# EasyEDA Pro project WEN-验证板合集2.epro

# Schematic 验证板2
Board Name: WEN-验证板合集2; Create Date: 2025-05-11; Page Name: BUF634A三通道缓冲器; Project Name: 【电赛模块】2025电赛预制模块mmkk; Schematic Name: 验证板2; Update Date: 2025-05-11; Company: 嘉立创EDA; Page Size: A1; Version: V1.0
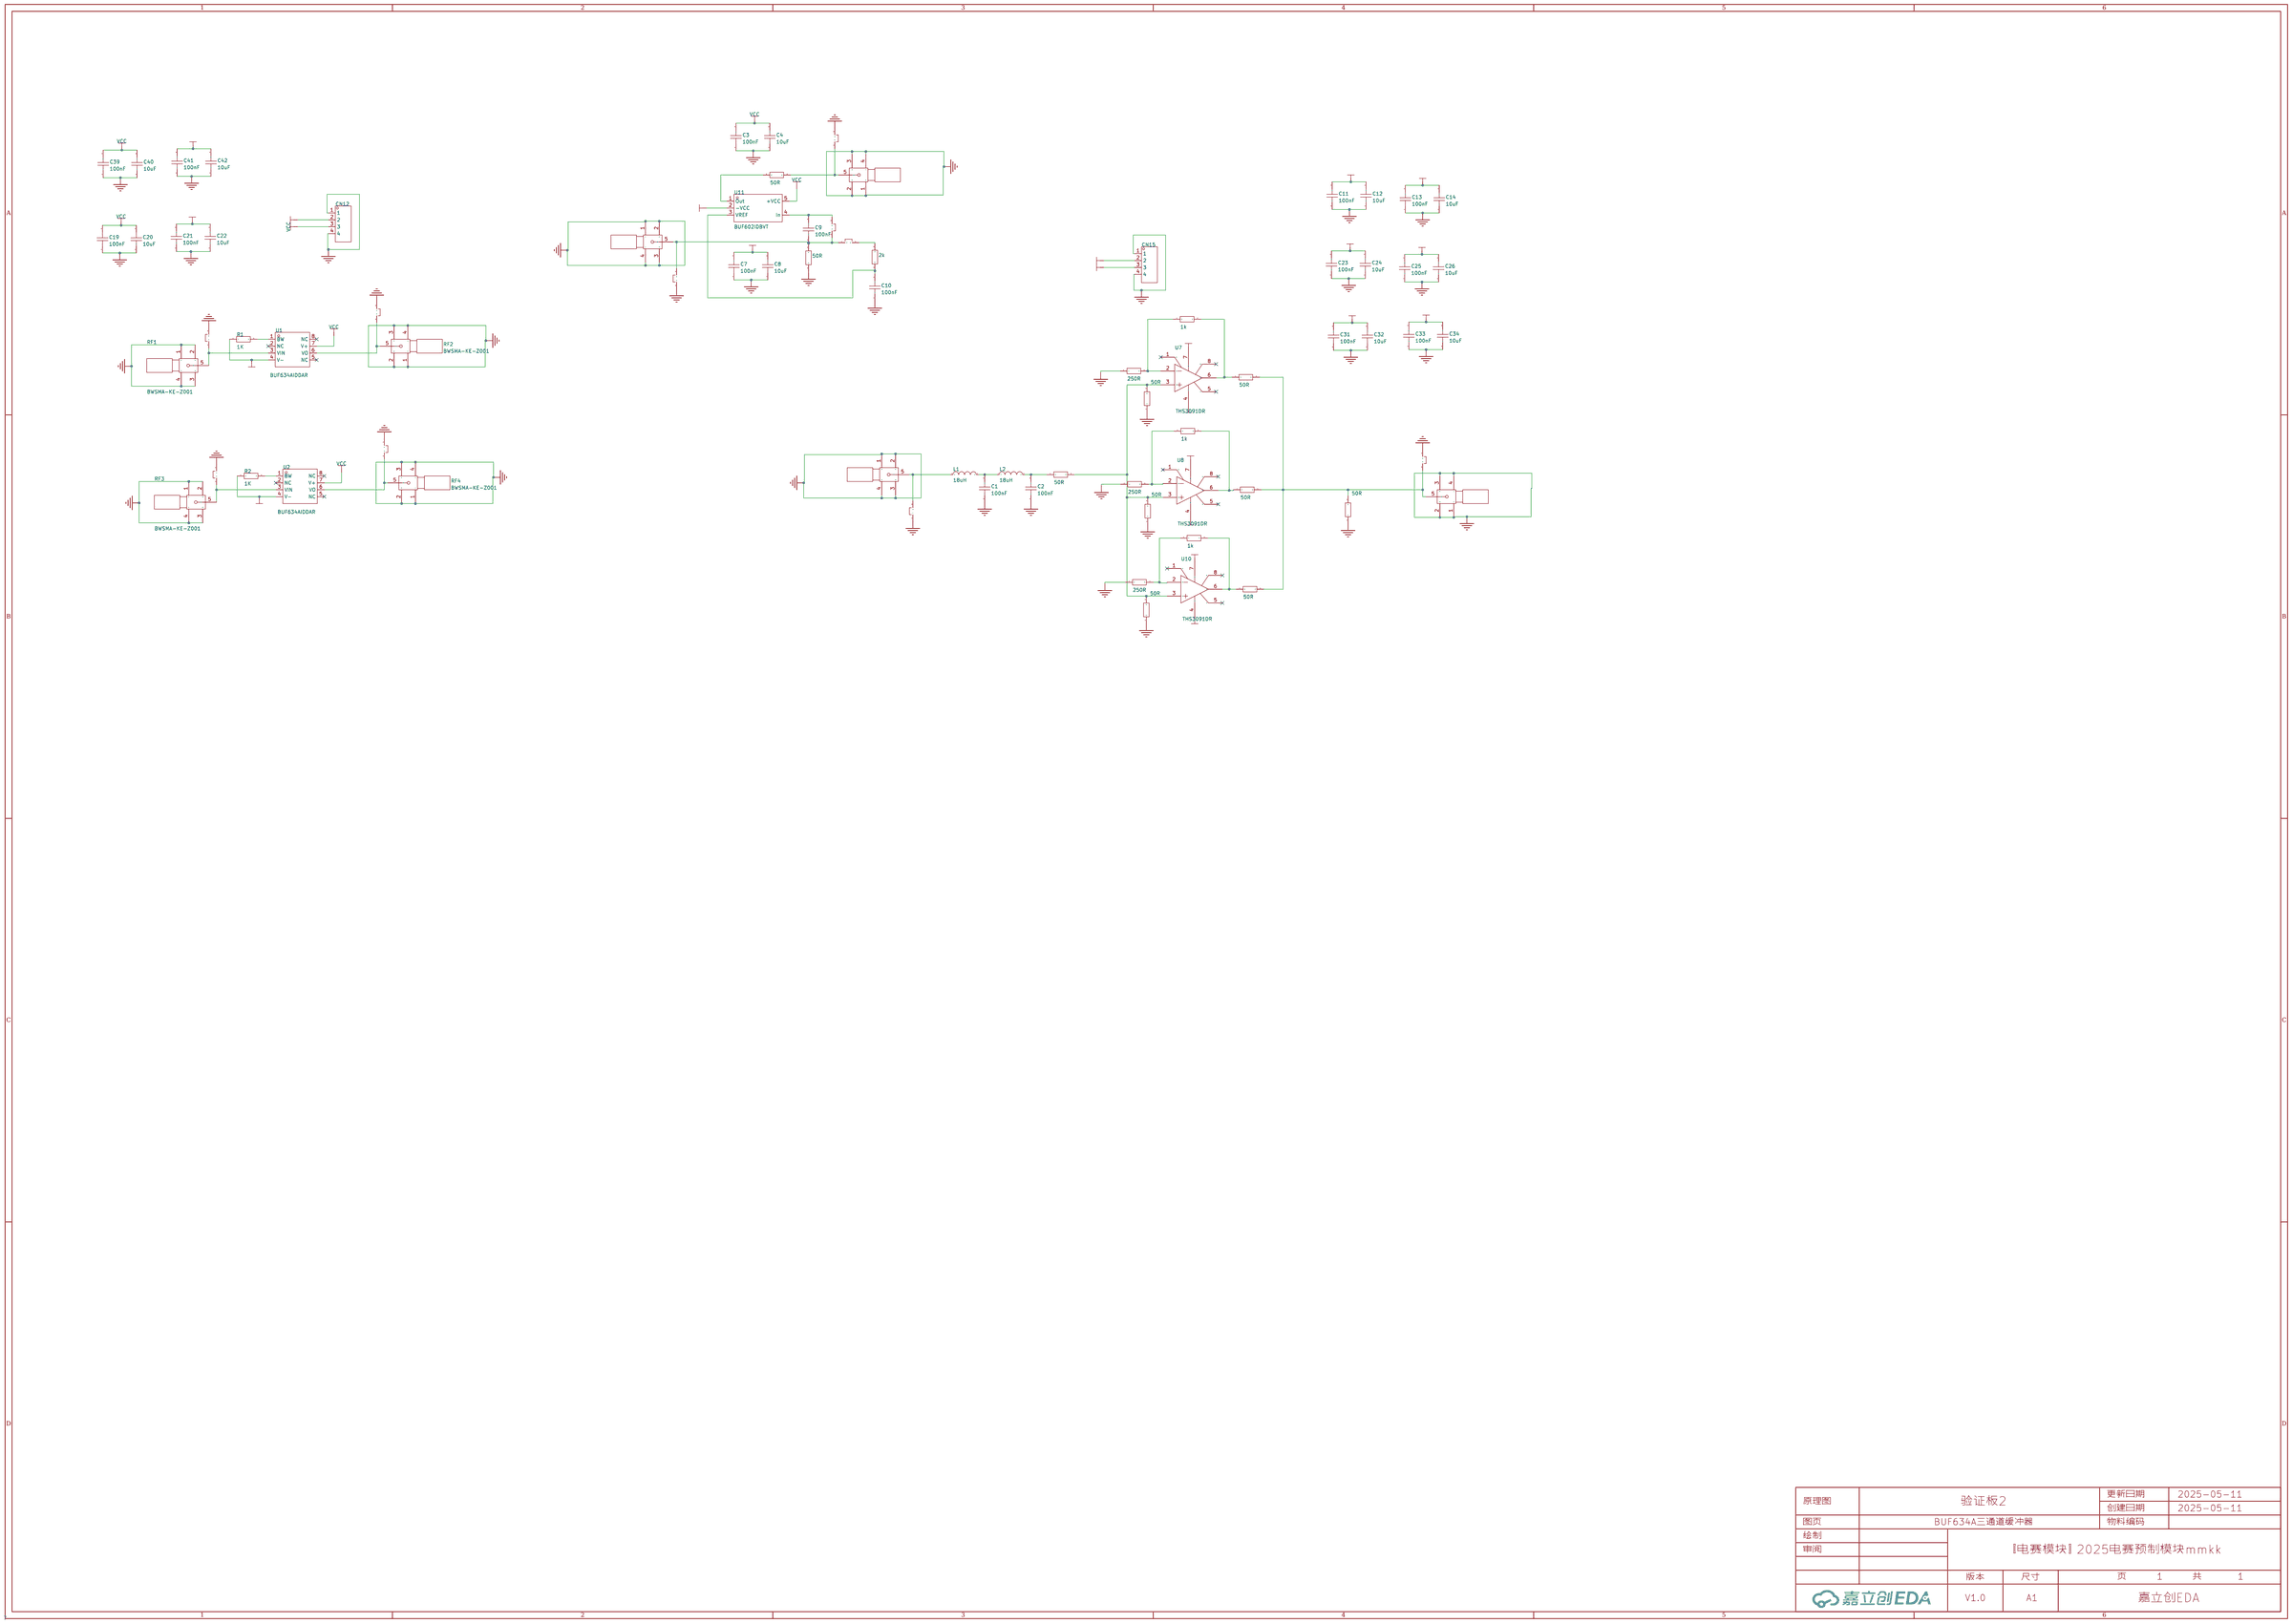
[diagram p0: schematic sheet]

## Parts
C1  100nF  [C0805]
C2  100nF  [C0805]
C3  100nF  [C0805]
C4  10uF  [C0805]
C7  100nF  [C0805]
C8  10uF  [C0805]
C9  100nF  [C0805]
C10  100nF  [C0805]
C11  100nF  [C0805]
C12  10uF  [C0805]
C13  100nF  [C0805]
C14  10uF  [C0805]
C19  100nF  [C0805]
C20  10uF  [C0805]
C21  100nF  [C0805]
C22  10uF  [C0805]
C23  100nF  [C0805]
C24  10uF  [C0805]
C25  100nF  [C0805]
C26  10uF  [C0805]
C31  100nF  [C0805]
C32  10uF  [C0805]
C33  100nF  [C0805]
C34  10uF  [C0805]
C39  100nF  [C0805]
C40  10uF  [C0805]
C41  100nF  [C0805]
C42  10uF  [C0805]
CN12  WJ15EDGVC-3.81-4P  [CONN-TH_4P-P3.81_WJ2EDGVC-3.81-4P]
CN15  WJ15EDGVC-3.81-4P  [CONN-TH_4P-P3.81_WJ2EDGVC-3.81-4P]
H1  PZ254V-11-02P  [HDR-TH_2P-P2.54-V-M]
H2  PZ254V-11-02P  [HDR-TH_2P-P2.54-V-M]
H3  PZ254V-11-02P  [HDR-TH_2P-P2.54-V-M]
H4  PZ254V-11-02P  [HDR-TH_2P-P2.54-V-M]
H5  PZ254V-11-02P  [HDR-TH_2P-P2.54-V-M]
H6  PZ254V-11-02P  [HDR-TH_2P-P2.54-V-M]
H7  PZ254V-11-02P  [HDR-TH_2P-P2.54-V-M]
H8  PZ254V-11-02P  [HDR-TH_2P-P2.54-V-M]
H9  PZ254V-11-02P  [HDR-TH_2P-P2.54-V-M]
H10  PZ254V-11-02P  [HDR-TH_2P-P2.54-V-M]
L1  18uH  [L0805]
L2  18uH  [L0805]
R1  1K  [R0603]
R2  1K  [R0603]
R7  1K  [R0603]
R8  1K  [R0603]
R10  1K  [R0603]
R11  1K  [R0603]
R12  1K  [R0603]
R13  1K  [R0603]
R14  1K  [R0603]
R15  1K  [R0603]
R16  1K  [R0603]
R17  1K  [R0603]
R18  1K  [R0603]
R19  1K  [R0603]
R22  1K  [R0603]
R23  1K  [R0603]
R24  1K  [R0603]
R26  1K  [R0603]
R27  1K  [R0603]
RF1  BWSMA-KE-Z001  [SMA-TH_BWSMA-KE-Z001]
RF2  BWSMA-KE-Z001  [SMA-TH_BWSMA-KE-Z001]
RF3  BWSMA-KE-Z001  [SMA-TH_BWSMA-KE-Z001]
RF4  BWSMA-KE-Z001  [SMA-TH_BWSMA-KE-Z001]
RF5  BWSMA-KE-Z001  [SMA-TH_BWSMA-KE-Z001]
RF6  BWSMA-KE-Z001  [SMA-TH_BWSMA-KE-Z001]
RF7  BWSMA-KE-Z001  [SMA-TH_BWSMA-KE-Z001]
RF8  BWSMA-KE-Z001  [SMA-TH_BWSMA-KE-Z001]
U1  BUF634AIDDAR  [SOIC-8_L4.9-W3.9-P1.27-LS6.0-BL]
U2  BUF634AIDDAR  [SOIC-8_L4.9-W3.9-P1.27-LS6.0-BL]
U7  THS3091DR  [SOIC-8_L4.9-W3.9-P1.27-LS6.0-BL]
U8  THS3091DR  [SOIC-8_L4.9-W3.9-P1.27-LS6.0-BL]
U10  THS3091DR  [SOIC-8_L4.9-W3.9-P1.27-LS6.0-BL]
U11  BUF602IDBVT  [SOT-23-5_L2.9-W1.6-P0.95-LS2.8-BL]

## Library data of the parts
C1-C4 C7-C14 C19-C26 C31-C34 C39-C42 = CAP_0805: Supplier Footprint: 0805
CN12 CN15 = WJ15EDGVC-3.81-4P: 连接器类型:板端/插座-闭口;固定方式:-;结构:1x4P;间距:3.81mm;颜色:-;安装方式:直针;排数:1;每排PIN数:4;额定电流:8A;额定电压:300V;线规 - AWG:-;线规 - 平方毫米:-;触头材质:黄铜;触头镀层:锡;工作温度范围:-40℃~+105℃;焊接温度(最大值):-;; LCSC Part Name: 1x4P 3.81mm 排数:1 每排P数:4; Supplier Part: C8410; Manufacturer: KANGNEX(康奈克斯电气); Supplier Footprint: 插件,P=3.81mm; JLCPCB Part Class: 扩展库; Datasheet: https://atta.szlcsc.com/upload/public/pdf/source/20191225/C8410_C8794F457058DA07325589F32B6A11CC.pdf; Supplier: LCSC; Connector Type: 板端/插座-闭口; Structure: 1x4P; Pitch: 3.81mm; Mounting Style: 直针; Number of Pins: 4P; Number of Rows: 1; Number of PINs Per Row: 4; Current Rating (Max): 8A; Voltage Rating (Max): 300V; Contact Material: 黄铜; Contact Plating: 锡; Operating Temperature Range: -40℃~+105℃
H1-H10 = PZ254V-11-02P: 排数:单排;总PIN位数:2;间距:2.54mm;插针结构:1x2P;行距:-;安装类型:直插;圆针/方针:方针;额定电流:-;额定电压:-;配合针长度:6mm;塑高:2.5mm;端接针长度:3mm;触头材质:黄铜;触头镀层:-;工作温度范围:-40℃~+105℃;颜色:黑色;; LCSC Part Name: 2.54mm 1x2P 直插 方针; Supplier Part: C492401; Manufacturer: XFCN(兴飞); Supplier Footprint: 直插,P=2.54mm; JLCPCB Part Class: Extended Part; Datasheet: https://atta.szlcsc.com/upload/public/pdf/source/20200309/C492401_A812433581A9B211A7FFA413ADDFF0E5.pdf; Supplier: LCSC; Number of Rows: 单排; Number of Pins: 2; Pitch: 2.54mm; Pin Structure: 1x2P; Mounting Type: 直插; Circluar Pins/Square Pins: 方针; Length of Mating Pin: 6mm; Insulation Height: 2.5mm; Length of End Connection Pin: 3mm; Contact Material: 黄铜; Operating Temperature Range: -40℃~+105℃; Color: 黑色
L1 L2 = L_0805
R1 R2 R7 R8 R10-R19 R22-R24 R26 R27 = Res_0603: Supplier Footprint: 0603
RF1-RF8 = 【直插】BWSMA-KE-Z001_C496549: 连接器类型:板端;接口类型:内孔;端口数量:1;接口直径:-;接口长度/高度:-;频率-最大值:-;射频系列:SMA;阻抗:50Ω;样式:正脚;触头材质:-;触头镀层:-;工作温度范围:-65℃~+165℃;焊接温度(最大值):-;; LCSC Part Name: 内孔 SMA 正脚; Supplier Part: C496549; Manufacturer: BAT WIRELESS(蝙蝠无线); Supplier Footprint: 插件; JLCPCB Part Class: 扩展库; Datasheet: https://atta.szlcsc.com/upload/public/pdf/source/20221228/40BF41E56A06003A0210E1785CA66EA6.pdf; Supplier: LCSC; Connector Type: 板端; Interface Type: 内孔; Number of Ports: 1; RF Series: SMA; Impedance: 50Ω; Style: 正脚; Operating Temperature Range: -65℃~+165℃
U1 U2 = BUF634AIDDAR: 放大器数:单路;轨到轨:-;增益带宽积(GBP):-;输入失调电压(Vos):65mV;压摆率(SR):3750V/us;输入偏置电流(Ib):250nA;; Supplier Part: C2864582; Manufacturer: TI(德州仪器); Supplier Footprint: SOIC-8; JLCPCB Part Class: Extended Part; Datasheet: https://www.ti.com/cn/lit/gpn/buf634a; Supplier: LCSC; Number of Circuits: 单路; Maximum Power Supply Range (Vdd-Vss): 36V; Voltage - Input Offset(Vos): 65mV; Input Offset Voltage Drift (Vos TC): 175uV/℃; Slew Rate(SR): 3750V/us; Current - Input Bias(Ib): 250nA; Noise density(eN): 3.4nV/√Hz@1kHz; Output Current: 250mA; Operating Temperature: -40℃~+125℃
U7 U8 U10 = THS3091DR: 放大器数:单路;增益带宽积(GBP):-;输入偏置电流(Ib):4uA;压摆率(SR):7300V/us;带宽(-3db):235MHz;; Supplier Part: C2060367; Manufacturer: TI(德州仪器); Supplier Footprint: SOIC-8; JLCPCB Part Class: 扩展库; Datasheet: https://www.ti.com/cn/lit/gpn/ths3091; Supplier: LCSC; Number of Circuits: 单路; Current - Input Bias(Ib): 4uA; Slew Rate(SR): 7300V/us; Output Current: 280mA; -3db Bandwidth: 235MHz; Operating Temperature: -40℃~+85℃
U11 = BUF602IDBVT: 放大器数:单路;轨到轨:-;增益带宽积(GBP):1GHz;输入失调电压(Vos):30mV;压摆率(SR):8000V/us;输入偏置电流(Ib):3uA;; Supplier Part: C2862949; Manufacturer: TI(德州仪器); Supplier Footprint: SOT-23-5; JLCPCB Part Class: 扩展库; Datasheet: https://www.ti.com/cn/lit/gpn/buf602; Supplier: LCSC; Number of Circuits: 单路; Maximum Power Supply Range (Vdd-Vss): 12.6V; Gain Bandwidth Product(GBP): 1GHz; Voltage - Input Offset(Vos): 30mV; Slew Rate(SR): 8000V/us; Current - Input Bias(Ib): 3uA; Output Current: 60mA; Operating Temperature: -45℃~+85℃

## Nets
GND: C1.1 C2.1 C3.1 C4.1 C7.1 C8.1 C10.1 C11.1 C12.1 C13.1 C14.1 C19.1 C20.1 C21.1 C22.1 C23.1 C24.1 C25.1 C26.1 C31.1 C32.1 C33.1 C34.1 C39.1 C40.1 C41.1 C42.1 CN12.1 CN12.4 CN15.1 CN15.4 H1.1 H2.2 H3.1 H4.2 H5.1 H6.1 H7.1 H8.1 R12.1 R14.1 R16.1 R17.1 R18.1 R19.1 R23.1 R24.1 RF1.1 RF1.2 RF1.3 RF1.4 RF2.1 RF2.2 RF2.3 RF2.4 RF3.1 RF3.2 RF3.3 RF3.4 RF4.1 RF4.2 RF4.3 RF4.4 RF5.1 RF5.2 RF5.3 RF5.4 RF6.1 RF6.2 RF6.3 RF6.4 RF7.1 RF7.2 RF7.3 RF7.4 RF8.1 RF8.2 RF8.3 RF8.4
VCC: C3.2 C4.2 C19.2 C20.2 C39.2 C40.2 CN12.3 U1.7(V+) U2.7(V+) U11.5(+VCC)
VDD: C11.2 C12.2 C23.2 C24.2 C31.2 C32.2 CN15.2 U7.7(VS+) U8.7(VS+) U10.7(VS+)
VEE: C7.2 C8.2 C21.2 C22.2 C41.2 C42.2 CN12.2 R1.1 R2.1 U1.4(V-) U2.4(V-) U11.2(−VCC)
VSS: C13.2 C14.2 C25.2 C26.2 C33.2 C34.2 CN15.3 U7.4(VS-) U8.4(VS-) U10.4(VS-)
$1N318: R1.2 U1.1(BW)
$1N722: H1.2 RF2.5 U1.6(VO)
$1N792: H2.1 RF1.5 U1.3(VIN)
$1N1467: R2.2 U2.1(BW)
$1N1487: H3.2 RF4.5 U2.6(VO)
$1N1494: H4.1 RF3.5 U2.3(VIN)
$1N3165: R7.1 R11.2 U7.6(VOUT)
$1N3277: R8.1 R13.2 U8.6(VOUT)
$1N3389: R10.1 R15.2 U10.6(VOUT)
$1N3456: R17.2 R18.2 R19.2 R22.2 U7.3(VIN+) U8.3(VIN+) U10.3(VIN+)
$1N3536: R11.1 R12.2 U7.2(VIN-)
$1N3731: R15.1 R16.2 U10.2(VIN-)
$1N3763: R13.1 R14.2 U8.2(VIN-)
$1N4774: C1.2 L1.2 L2.1
$1N4777: C2.2 L2.2 R22.1
$1N5308: H5.2 L1.1 RF5.5
$1N5838: R26.2 U11.1(Out)
$1N5843: H8.2 R26.1 RF8.5
$1N6032: C9.1 H7.2 H9.2 H10.1 R24.2 RF7.5
$1N6070: C10.2 R27.1 U11.3(VREF)
$1N6153: H10.2 R27.2
$1N6159: C9.2 H9.1 U11.4(In)
$1N6676: H6.2 R7.2 R8.2 R10.2 R23.2 RF6.5

Not connected (* = marked no-connect by the designer): U1 2(NC)* 5(NC)* 8(NC)*; U2 2(NC)* 5(NC)* 8(NC)*; U7 1(NC)* 5(NC)* 8(NC)*; U8 1(NC)* 5(NC)* 8(NC)*; U10 1(NC)* 5(NC)* 8(NC)*

# Board 验证板2
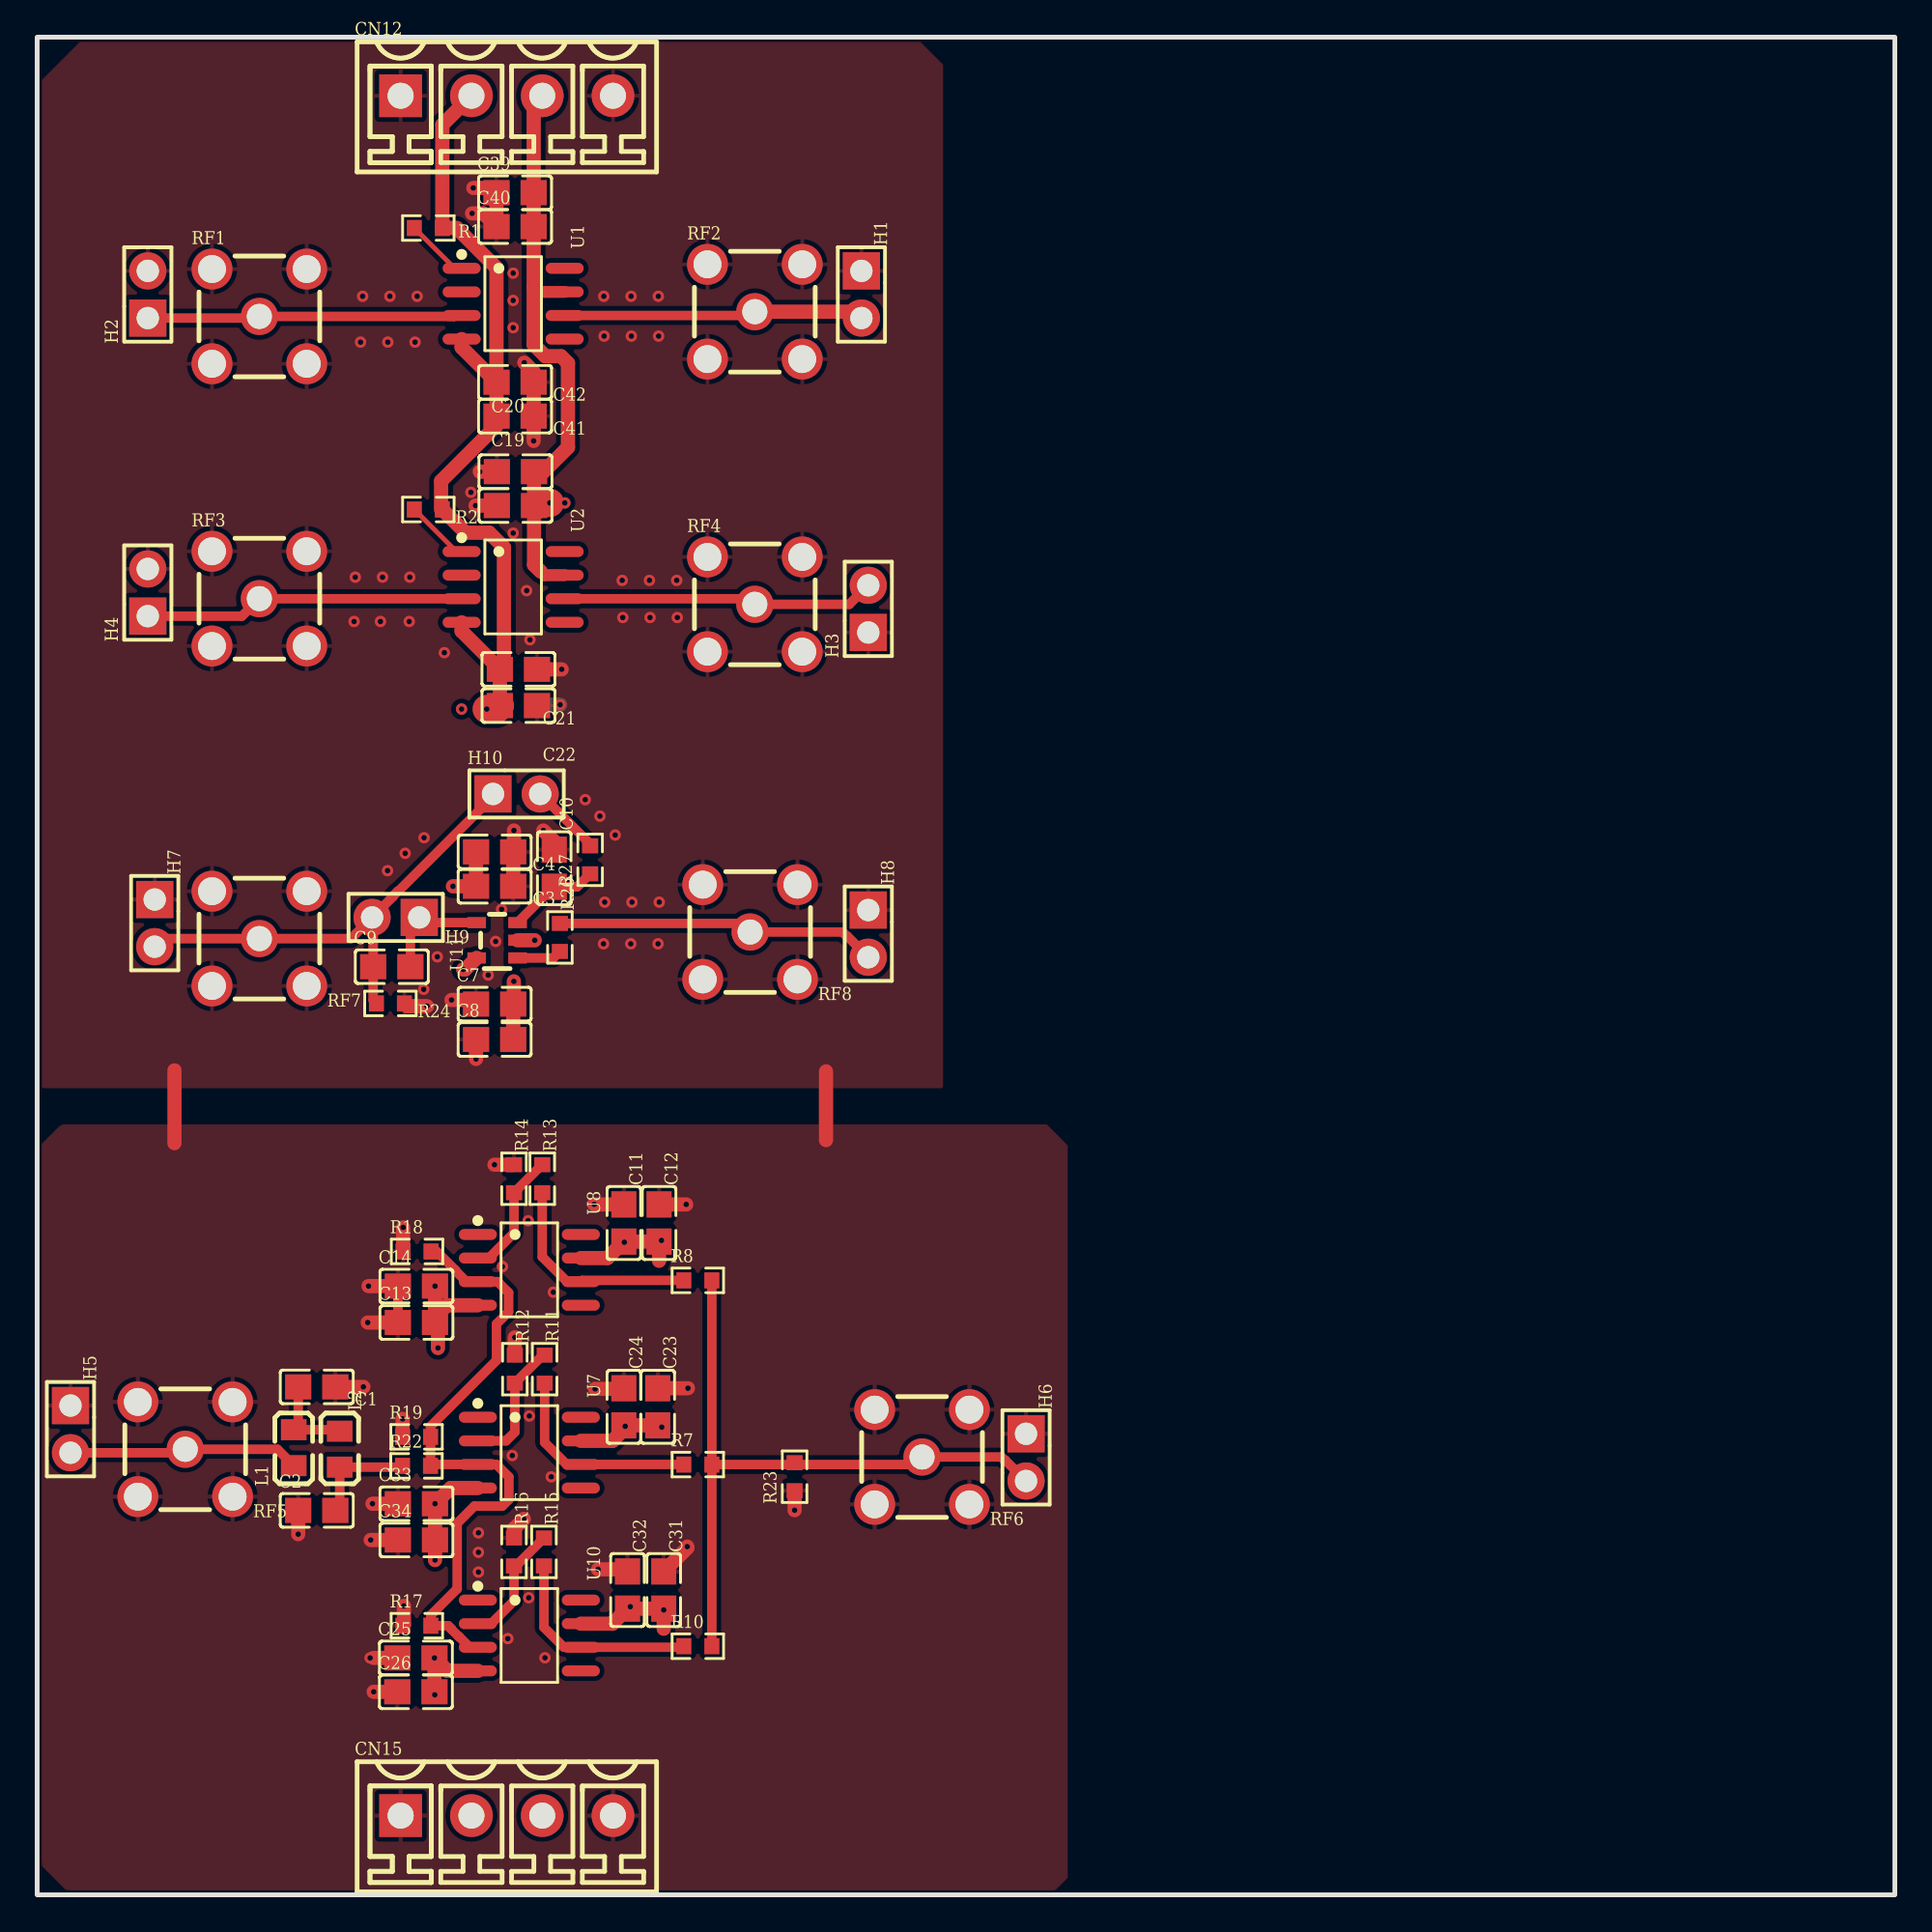
[diagram p1: board, top side]
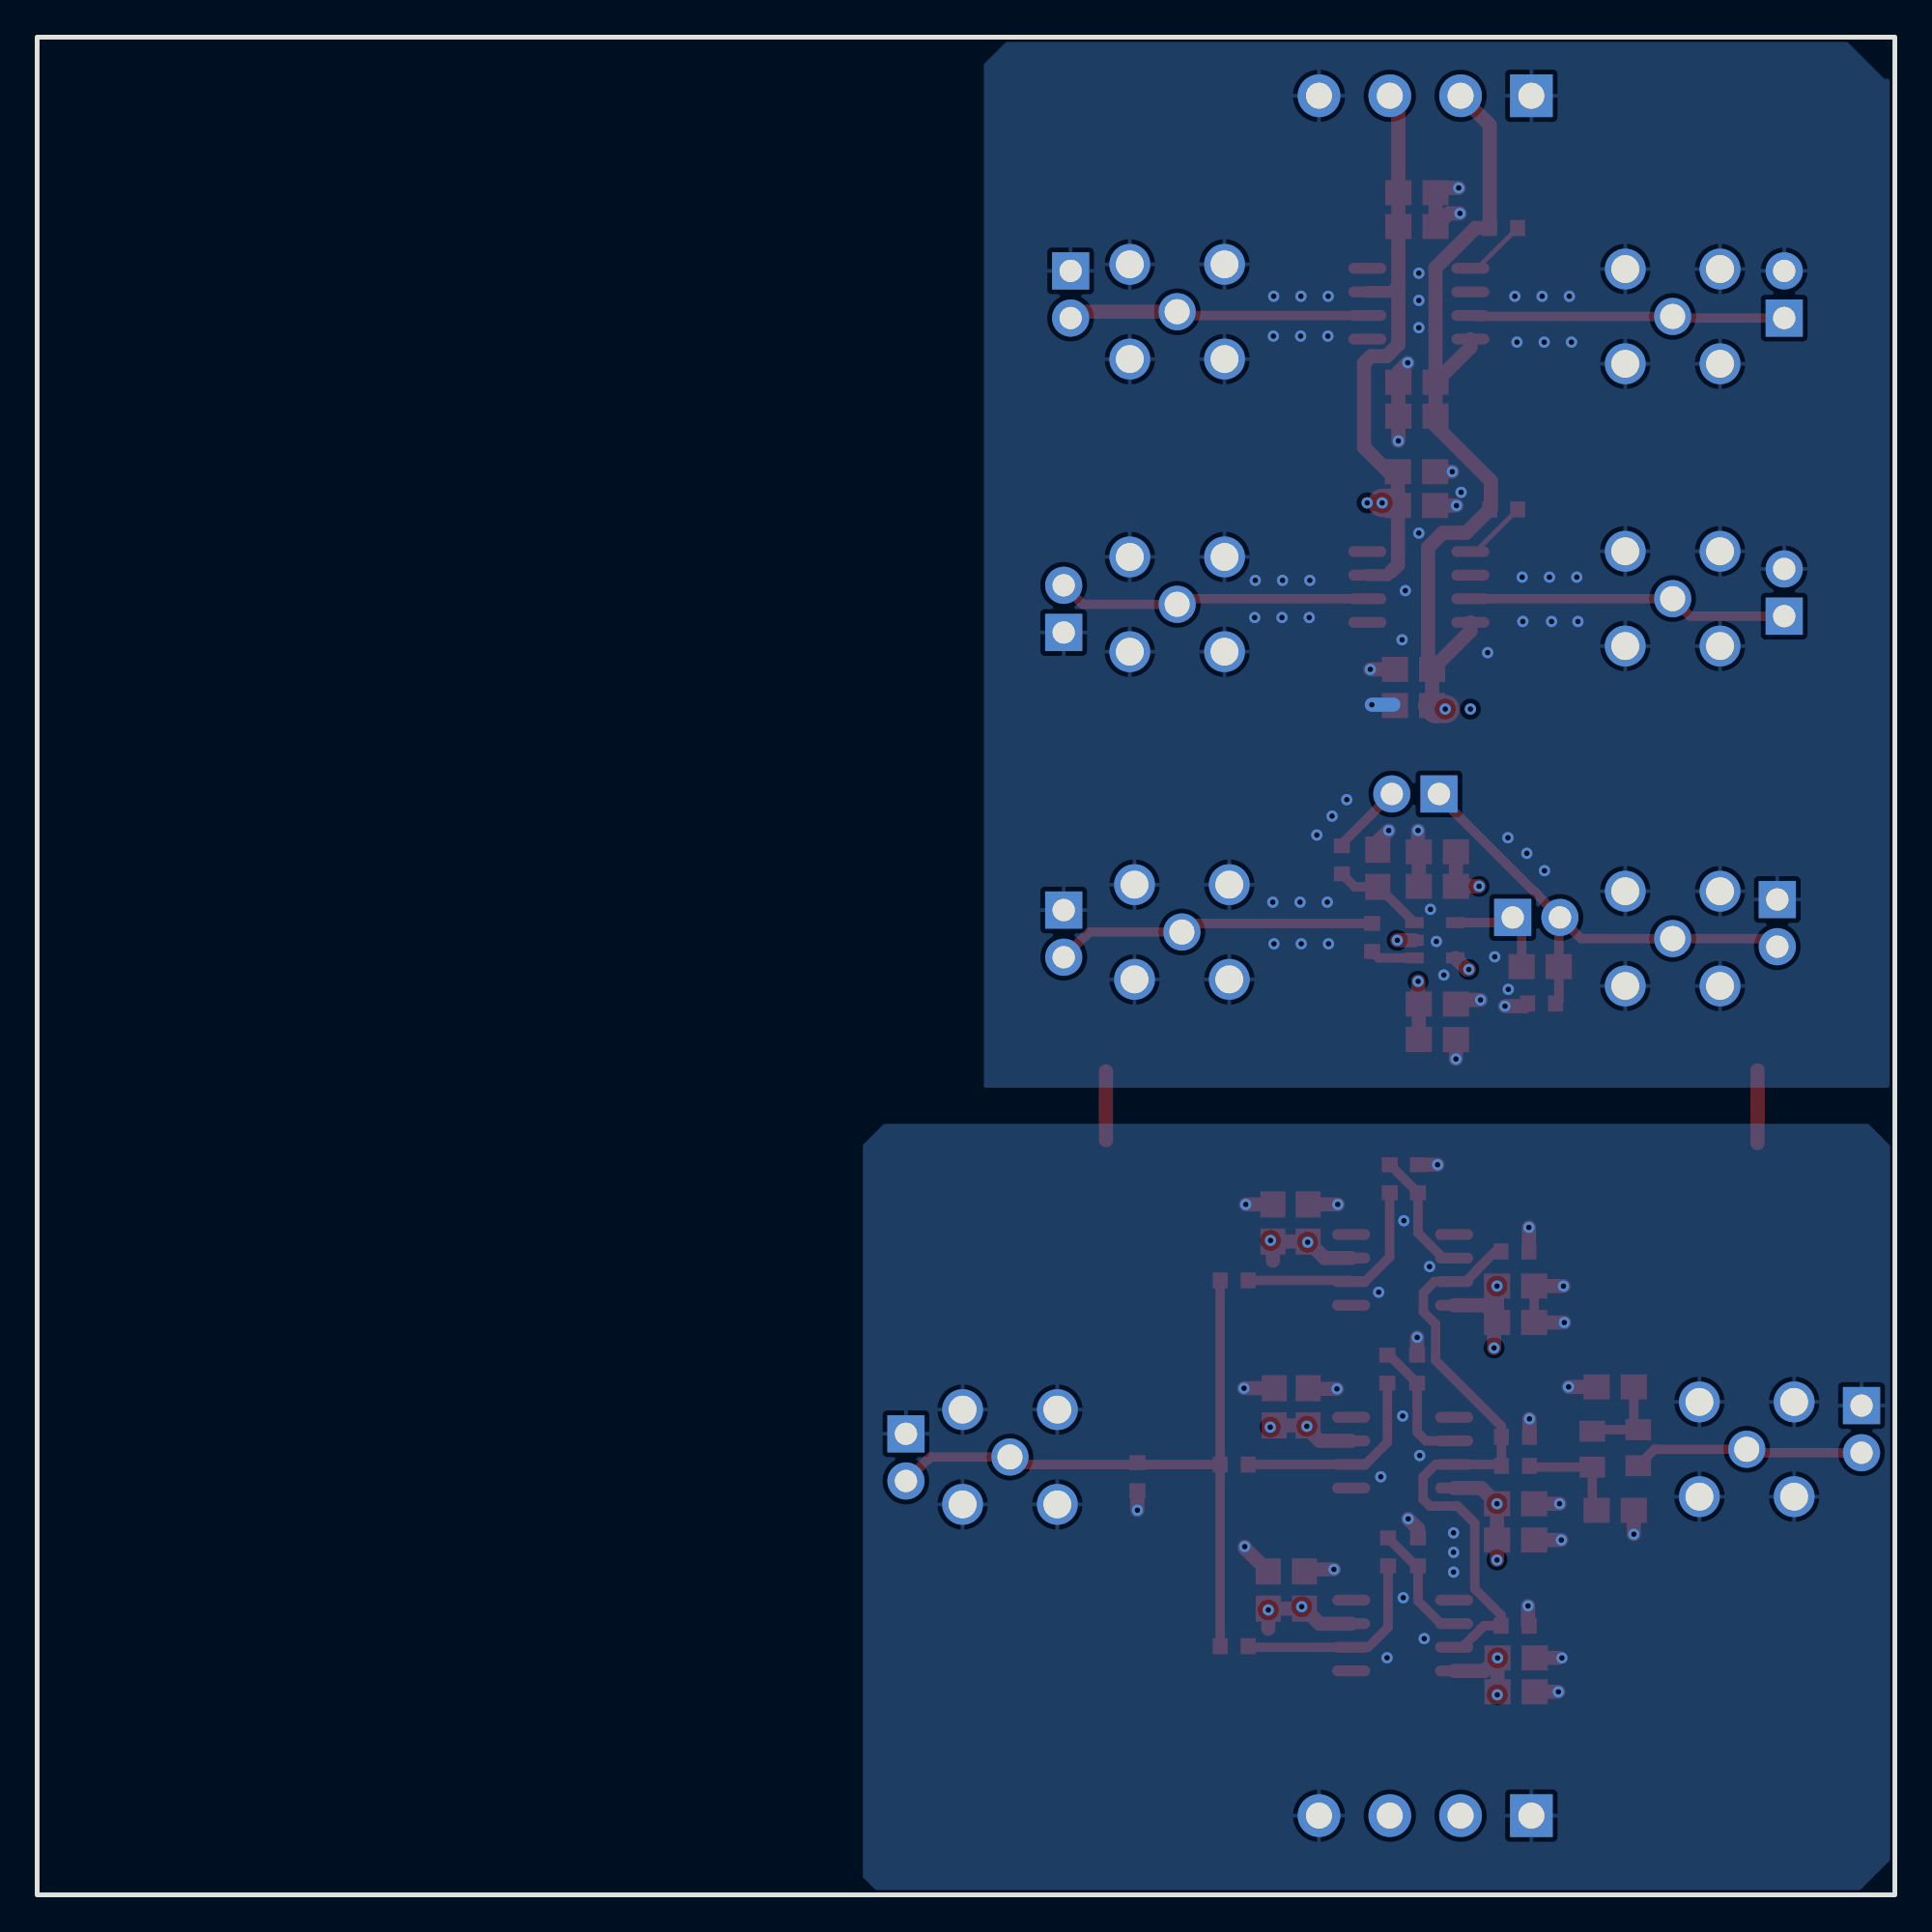
[diagram p2: board, bottom side, seen from below]

Outline 100 x 100 mm; copper layers: Top Layer, Inner1, Inner2, Bottom Layer. Coordinates in mm from the lower left corner of the outline.
Outline path: rectangle 0,100 100,0
Stack: Top Layer 0.035mm 外层铜厚1oz / Dielectric1 0.2104mm 7628 RC49% 8.6mil / Inner1 0.0152mm 内层铜厚 / Dielectric2 1.065mm 1.1mm H/HOZ Copper / Inner2 0.0152mm 内层铜厚 / Dielectric3 0.2104mm 7628 RC49% 8.6mil / Bottom Layer 0.035mm 外层铜厚1oz

## Design rules (mm)
net GND: PWR
net VEE: PWR
net VCC: PWR
net $1N722: SIG
net $1N792: SIG
net $1N318: SIG
net $1N4774: SIG
net $1N4777: SIG
net $1N6159: SIG
net $1N6032: SIG
net $1N6070: SIG
net VDD: PWR
net VSS: PWR
net $1N1487: SIG
net $1N1494: SIG
net $1N5308: SIG
net $1N5843: SIG
net $1N6153: SIG
net $1N1467: SIG
net $1N3165: SIG
net $1N3277: SIG
net $1N3389: SIG
net $1N3536: SIG
net $1N3763: SIG
net $1N3731: SIG
net $1N3456: SIG
net $1N5838: SIG
net $1N6676: SIG
template: 自定义配置
spacing copperThickness1oz (default): track to track 0.102, other pairs 0.152 to 0.3
spacing copperThickness2oz: track to track 0.203, other pairs 0.152 to 0.3
track width copperThickness1oz (default): min 0.127, default 0.508, max 2.54
track width copperThickness2oz: min 0.203, default 0.254, max 2.54
track width PWR: min 0.127, default 0.762, max 2.54
differential pair differentialPair (default): width min 0.127, default 0.254, max 2.54; gap min 0.152, default 0.152
via viaSize (default): diameter min 0.5, default 0.61, max 10; hole min 0.3, default 0.305, max 6.299
net class PWR uses PWR
net GND uses PWR
net VEE uses PWR
net VCC uses PWR
net VDD uses PWR
net VSS uses PWR

## Placement (name value [footprint] x y rotation side)
C1  100nF  [C0805]  15.05 27.34 180 top
C2  100nF  [C0805]  15.05 20.7 0 top
C3  100nF  [C0805]  24.63 54.29 180 top
C4  10uF  [C0805]  24.63 56.14 180 top
C7  100nF  [C0805]  24.63 47.95 0 top
C8  10uF  [C0805]  24.63 46.04 0 top
C9  100nF  [C0805]  19.09 49.96 0 top
C10  100nF  [C0805]  27.83 55.26 270 top
C11  100nF  [C0805]  31.58 36.17 270 top
C12  10uF  [C0805]  33.48 36.17 270 top
C13  100nF  [C0805]  20.42 30.81 0 top
C14  10uF  [C0805]  20.42 32.77 0 top
C19  100nF  [C0805]  25.75 74.79 0 top
C20  10uF  [C0805]  25.75 76.61 0 top
C21  100nF  [C0805]  25.91 65.97 180 top
C22  10uF  [C0805]  25.91 64.02 180 top
C23  100nF  [C0805]  33.41 26.27 270 top
C24  10uF  [C0805]  31.58 26.27 270 top
C25  100nF  [C0805]  20.39 12.75 0 top
C26  10uF  [C0805]  20.39 10.93 0 top
C31  100nF  [C0805]  33.73 16.41 270 top
C32  10uF  [C0805]  31.78 16.41 270 top
C33  100nF  [C0805]  20.42 21.05 0 top
C34  10uF  [C0805]  20.42 19.1 0 top
C39  100nF  [C0805]  25.73 91.63 0 top
C40  10uF  [C0805]  25.73 89.8 0 top
C41  100nF  [C0805]  25.73 79.6 180 top
C42  10uF  [C0805]  25.73 81.42 180 top
CN12  WJ15EDGVC-3.81-4P  [CONN-TH_4P-P3.81_WJ2EDGVC-3.81-4P]  25.28 96.85 0 top
CN15  WJ15EDGVC-3.81-4P  [CONN-TH_4P-P3.81_WJ2EDGVC-3.81-4P]  25.28 4.26 0 top
H1  PZ254V-11-02P  [HDR-TH_2P-P2.54-V-M]  44.37 86.15 270 top
H2  PZ254V-11-02P  [HDR-TH_2P-P2.54-V-M]  5.96 86.15 90 top
H3  PZ254V-11-02P  [HDR-TH_2P-P2.54-V-M]  44.74 69.22 90 top
H4  PZ254V-11-02P  [HDR-TH_2P-P2.54-V-M]  5.96 70.1 90 top
H5  PZ254V-11-02P  [HDR-TH_2P-P2.54-V-M]  1.79 25.07 270 top
H6  PZ254V-11-02P  [HDR-TH_2P-P2.54-V-M]  53.23 23.55 270 top
H7  PZ254V-11-02P  [HDR-TH_2P-P2.54-V-M]  6.33 52.31 270 top
H8  PZ254V-11-02P  [HDR-TH_2P-P2.54-V-M]  44.74 51.74 270 top
H9  PZ254V-11-02P  [HDR-TH_2P-P2.54-V-M]  19.3 52.61 180 top
H10  PZ254V-11-02P  [HDR-TH_2P-P2.54-V-M]  25.81 59.26 0 top
L1  18uH  [L0805]  13.81 24.07 90 top
L2  18uH  [L0805]  16.29 23.99 270 top
R1  1K  [R0603]  21.06 89.73 180 top
R2  1K  [R0603]  21.06 74.57 180 top
R7  1K  [R0603]  35.56 23.16 0 top
R8  1K  [R0603]  35.56 33.08 0 top
R10  1K  [R0603]  35.56 13.38 0 top
R11  1K  [R0603]  27.32 28.3 270 top
R12  1K  [R0603]  25.71 28.3 270 top
R13  1K  [R0603]  27.19 38.55 270 top
R14  1K  [R0603]  25.67 38.55 270 top
R15  1K  [R0603]  27.28 18.46 270 top
R16  1K  [R0603]  25.67 18.46 270 top
R17  1K  [R0603]  20.44 14.49 0 top
R18  1K  [R0603]  20.45 34.63 0 top
R19  1K  [R0603]  20.42 24.65 0 top
R22  1K  [R0603]  20.42 23.09 0 top
R23  1K  [R0603]  40.77 22.51 90 top
R24  1K  [R0603]  19.02 47.98 180 top
R26  1K  [R0603]  28.14 51.54 270 top
R27  1K  [R0603]  29.77 55.72 90 top
RF1  BWSMA-KE-Z001  [SMA-TH_BWSMA-KE-Z001]  11.96 84.97 0 top
RF2  BWSMA-KE-Z001  [SMA-TH_BWSMA-KE-Z001]  38.63 85.22 0 top
RF3  BWSMA-KE-Z001  [SMA-TH_BWSMA-KE-Z001]  11.96 69.77 0 top
RF4  BWSMA-KE-Z001  [SMA-TH_BWSMA-KE-Z001]  38.63 69.47 0 top
RF5  BWSMA-KE-Z001  [SMA-TH_BWSMA-KE-Z001]  7.97 23.98 180 top
RF6  BWSMA-KE-Z001  [SMA-TH_BWSMA-KE-Z001]  47.63 23.57 180 top
RF7  BWSMA-KE-Z001  [SMA-TH_BWSMA-KE-Z001]  11.96 51.48 180 top
RF8  BWSMA-KE-Z001  [SMA-TH_BWSMA-KE-Z001]  38.38 51.83 180 top
U1  BUF634AIDDAR  [SOIC-8_L4.9-W3.9-P1.27-LS6.0-BL]  25.62 85.65 270 top
U2  BUF634AIDDAR  [SOIC-8_L4.9-W3.9-P1.27-LS6.0-BL]  25.62 70.4 270 top
U7  THS3091DR  [SOIC-8_L4.9-W3.9-P1.27-LS6.0-BL]  26.49 23.8 270 top
U8  THS3091DR  [SOIC-8_L4.9-W3.9-P1.27-LS6.0-BL]  26.49 33.64 270 top
U10  THS3091DR  [SOIC-8_L4.9-W3.9-P1.27-LS6.0-BL]  26.49 13.96 270 top
U11  BUF602IDBVT  [SOT-23-5_L2.9-W1.6-P0.95-LS2.8-BL]  24.76 51.39 90 top

## Footprints (pads in the part's own frame, mm; a bottom-side part is the same pattern mirrored in y, then rotated)
C0805
  rect 1.41x1.35 smd: 1(-1,0) 2(1,0)
CONN-TH_4P-P3.81_WJ2EDGVC-3.81-4P
  rect 2.3x2.3 hole 1.4: 1(-5.715,0)
  round 2.3 hole 1.4: 2(-1.905,0) 3(1.905,0) 4(5.715,0)
HDR-TH_2P-P2.54-V-M
  rect 2x2 hole 1.2: 1(-1.27,0)
  round 2 hole 1.2: 2(1.27,0)
L0805
  rect 1.133x1.377 smd: 1(-0.966,0) 2(0.966,0)
R0603
  rect 0.806x0.864 smd: 1(-0.753,0) 2(0.753,0)
SMA-TH_BWSMA-KE-Z001
  round 2.2 hole 1.5: 1(-2.55,-2.55) 2(-2.55,2.55) 3(2.55,2.55) 4(2.55,-2.55)
  round 2 hole 1.35: 5(0,0)
SOIC-8_L4.9-W3.9-P1.27-LS6.0-BL
  oval 0.588x2.045 smd: 1(-1.905,-2.772) 2(-0.635,-2.772) 3(0.635,-2.772) 4(1.905,-2.772) 5(1.905,2.772) 6(0.635,2.772) 7(-0.635,2.772) 8(-1.905,2.772)
SOT-23-5_L2.9-W1.6-P0.95-LS2.8-BL
  rect 0.6x1 smd: 1(-0.95,-1.1) 2(0,-1.1) 3(0.95,-1.1) 4(0.95,1.1) 5(-0.95,1.1)

## Nets
As in the schematic.

Pads without a net: U1 2 5 8; U2 2 5 8; U7 1 5 8; U8 1 5 8; U10 1 5 8

## Via types
v1: diameter 0.61, hole 0.305, Top Layer to Bottom Layer, 115 vias

## Routing (per net, layer and track width the routed paths; a pad name or vN(x,y) marks a point on that pad's centre or on a via; arc(x,y) is an arc through that point)
GND: length 60.1
  Top Layer w0.254: 19.42,31.04 C13.1
  Top Layer w0.508: C14.1 19.42,31.04
  Top Layer w0.762: R16.1 25.67,19.71 v1(26.19,20.24) ; v1(23.48,91.88) 24.47,91.88 C39.1 C40.1 24.02,90.51 v1(23.41,90.51) ; C13.1 v1(17.8,30.81) ; C32.1 31.66,17.52 v1(30.19,17.52) ; C1.1 v1(17.56,27.34) ; R12.1 v1(25.71,30.01) ; C3.1 C4.1 25.67,56.18 v1(25.67,57.3) ; v1(26.73,78.27) C41.1 C42.1 26.73,81.97 v1(26.22,82.47) ; C10.1 27.83,56.71 v1(27.25,57.3) ; C33.1 v1(18.05,21.05) ; C8.1 v1(23.63,45) ; C2.1 v1(14.05,19.42) ; v1(20.99,47.84) 19.91,47.84 R24.1 ; C23.1 v1(35.03,27.27) ; C26.1 v1(18.11,10.93) ; C14.1 v1(17.84,32.77) ; 7.39,44.38 7.39,40.47 ; C31.1 35,18.68 v1(35,18.75) ; v1(30.03,27.24) 31.55,27.24 C24.1 ; C20.1 v1(23.82,76.61) ; C12.1 v1(34.94,37.17) ; R23.1 v1(40.77,20.71) ; C21.1 v1(28.24,65.97) ; R17.1 19.74,14.55 v1(19.74,15.55) ; C11.1 v1(29.99,37.17) ; C34.1 v1(17.95,19.1) ; C25.1 18.11,12.75 ; 19.67,24.65 v1(19.67,25.62) ; R18.1 v1(19.7,35.93) ; v1(22.3,48.17) 23.4,48.17 C7.1 ; C19.1 v1(23.6,74.79) ; R14.1 v1(24.62,39.3) ; 42.46,44.33 42.46,40.63
  Bottom Layer w0.762: 27,64.07 v1(28.16,64.07)
  vias: v1(17.12,70.93) v1(17.06,68.55) v1(17.41,83.58) v1(17.52,86.05) v1(17.92,12.75) v1(18.48,68.55) v1(18.59,70.93) v1(18.88,83.58) v1(18.86,55.13) v1(18.99,86.05) v1(19.81,56.07) v1(20.03,68.55) v1(20.06,70.93) v1(20.34,83.58) v1(20.46,86.05) v1(20.83,56.91) v1(20.81,48.74) v1(21.54,50.49) v1(21.92,66.87) v1(23.35,75.5) v1(23.75,19.49) v1(23.75,18.44) v1(23.75,17.37) v1(24.28,49.51) v1(24.68,51.32) v1(25,53.05) v1(25.05,33.82) v1(25.33,13.79) v1(25.62,87.3) v1(25.62,85.83) v1(25.62,84.36) v1(25.62,73.3) v1(25.58,23.65) v1(26.35,70.21) v1(26.43,36.29) v1(26.53,67.56) v1(26.49,25.78) v1(26.46,15.99) v1(27.33,12.76) v1(27.67,22.5) v1(27.79,32.44) v1(29.5,58.95) v1(30.29,58.07) v1(30.5,86.05) v1(30.52,83.91) v1(30.49,51.19) v1(30.55,53.44) v1(31.12,57.05) v1(31.49,70.76) v1(31.52,68.76) v1(31.97,86.05) v1(31.99,83.91) v1(32.02,53.44) v1(31.95,51.19) v1(32.96,70.76) v1(32.99,68.76) v1(33.44,86.05) v1(33.42,51.19) v1(33.45,83.91) v1(33.49,53.44) v1(34.43,70.76) v1(34.46,68.76)
VCC: length 68.6
  Top Layer w0.635: 27.1,71.24 27.3,71.04 U2.7 ; U1.7 27.02,86.29 26.92,86.39
  Top Layer w0.762: U11.5 23.04,49.81 v1(22.93,49.81) ; 26.73,86.58 C40.2 C39.2 26.73,96.38 CN12.3 ; 26.73,86.58 26.92,86.39 ; 26.73,86.58 26.73,83.45 27.36,82.82 28.2,82.82 28.57,82.45 28.57,77.92 27.27,76.61 C20.2 C19.2 26.75,71.59 27.1,71.24 ; C4.2 C3.2 v1(22.38,54.29)
  Top Layer w1.524: 27.02,74.86 27.09,74.93 v1(27.6,74.93)
  Inner2 w1.524: v1(22.93,49.81) 22.93,53.74 v1(22.38,54.29) 22.38,60.4 23.16,61.18 27.71,61.18 29.8,63.26 29.8,73.53 v1(28.41,74.93) v1(27.6,74.93)
VDD: length 65.3
  Top Layer w0.762: 32,25.27 C23.2 33.5,25.18 v1(33.62,25.18) ; 29.27,14.6 30.97,14.6 C32.2 C31.2 33.73,14.33 ; 29.27,24.44 30.97,24.44 31.45,24.92 ; 33.48,34.14 C12.2 C11.2 30.7,34.28 29.27,34.28
  Inner2 w1.524: v1(31.65,25.22) 33.49,25.22 33.73,24.99 ; 33.73,24.99 v1(33.73,15.33) ; 33.73,24.99 33.73,34.77 33.37,35.13 v1(31.61,35.13) ; v1(33.73,15.33) 33.73,3.04 32.65,1.96 25.68,1.96 CN15.2 ; v1(33.73,15.33) 31.93,15.33 31.88,15.28
  vias: v1(31.93,15.51) v1(33.61,35.23)
VEE: length 106.8
  Top Layer w0.635: 25.13,66.19 25.13,65.98 24.91,65.77
  Top Layer w0.762: U1.4 22.85,83.3 C42.2 ; 21.74,74.57 21.74,76.11 24.73,79.09 C41.2 C42.2 ; C42.2 24.73,87.58 22.58,89.73 R1.1 21.81,95.28 CN12.2 ; C8.2 C7.2 25.66,47.99 v1(25.66,49.17) ; C21.2 22.85,68.03 U2.4 ; U11.2 v1(26.78,51.39) ; R2.1 23.06,73.32 24.33,73.32 25.13,72.53 25.13,66.19 ; 24.91,65.77 C22.2
  Top Layer w1.524: C22.2 24.72,63.83 v1(24.2,63.83)
  Inner2 w1.524: v1(24.2,63.83) v1(22.85,63.83) 20.6,63.83 14.02,57.25 6.18,57.25 3.6,54.68 3.6,48.94 5.93,46.62 23.11,46.62 v1(25.66,49.17) 26.78,50.3 v1(26.78,51.39)
VSS: length 46.9
  Top Layer w0.762: v1(21.58,29.44) 21.58,30.65 C13.2 ; v1(21.4,10.77) 21.4,10.91 C26.2 v1(21.39,12.75) 22.08,12.06 U10.4 ; v1(21.42,18.02) C34.2 v1(21.42,21.05) 22.26,21.9 U7.4 ; U8.4 22.06,31.74 21.42,31.1 v1(21.42,32.77)
  Inner2 w1.524: CN15.3 21.4,10.05 v1(21.4,10.77) 21.4,12.74 v1(21.39,12.75) 21.39,32.75
$1N318: length 3.4
  Top Layer w0.254: R1.2 22.47,87.56 U1.1
$1N722: length 16.5
  Top Layer w0.508: 38.63,85.22 38.43,85.02 U1.6
  Top Layer w0.762: 38.63,85.22 43.83,85.22 44.37,84.68 44.37,84.46
$1N792: length 17
  Top Layer w0.254: 6.34,84.88 H2.1
  Top Layer w0.508: U1.3 22.49,85.02 22.44,84.97 11.96,84.97 11.87,84.88 6.34,84.88
$1N1467: length 3.8
  Top Layer w0.254: 23.21,72.31 22.57,72.31 R2.2
$1N1487: length 16.9
  Top Layer w0.508: H3.2 43.72,69.47 RF4.5 38.33,69.77 U2.6
$1N1494: length 17.3
  Top Layer w0.508: U2.3 11.97,69.77 11.96,69.77 11.02,68.83 H4.1
$1N3165: length 11.2
  Top Layer w0.254: 28.52,23.15 29.25,23.15
  Top Layer w0.508: R7.1 34.8,23.17 29.27,23.17 ; 28.52,23.15 27.32,24.35 R11.2
$1N3277: length 10.8
  Top Layer w0.508: R8.1 29.33,33.08 29.27,33.01 ; R13.2 27.19,34.34 28.45,33.08
$1N3389: length 11.3
  Top Layer w0.254: 28.35,13.33 29.27,13.33
  Top Layer w0.508: R15.2 27.28,14.4 28.35,13.33 ; R10.1 34.75,13.33 29.27,13.33
$1N3456: length 34.4
  Top Layer w0.254: 23.29,13.33 U10.3 ; 23.08,33.03 23.71,33.03 23.74,33.01
  Top Layer w0.508: U8.3 24.78,33.01 25.38,32.41 25.38,31.38 24.72,30.73 24.72,28.77 21.17,25.22 R22.2 21.25,23.17 U7.3 24.72,23.17 25.39,22.5 25.39,21.29 25.03,20.93 23.53,20.93 22.61,20 22.61,16.47 21.19,15.06 21.19,14.49 22.12,14.49 22.29,14.32 22.29,14.31 22.7,13.9 22.72,13.9 23.29,13.33 ; R18.2 21.51,34.63 22.53,33.61 22.53,33.59 23.08,33.03
$1N3536: length 7
  Top Layer w0.508: R11.1 27.22,29.05 R12.2 25.71,24.91 25.24,24.44 U7.2
$1N3731: length 6.6
  Top Layer w0.254: 24.44,14.6 U10.2
  Top Layer w0.508: R15.1 25.77,17.71 R16.2 25.67,15.83 24.44,14.6
$1N3763: length 6.8
  Top Layer w0.254: 24.32,34.28 23.74,34.28
  Top Layer w0.508: R13.1 27.18,39.3 R14.2 25.67,35.63 24.32,34.28
$1N4774: length 4.9
  Top Layer w0.254: 14.05,25.28 13.81,25.04 ; 16.22,25.04 16.29,24.97
  Top Layer w0.508: 13.81,25.04 16.22,25.04 ; C1.2 14.05,25.28
$1N4777: length 5.8
  Top Layer w0.508: C2.2 16.29,20.93 L2.2 19.6,23.02 R22.1
$1N5308: length 12.5
  Top Layer w0.254: 7.78,23.8 RF5.5
  Top Layer w0.508: L1.1 12.93,23.98 RF5.5 ; H5.2 7.78,23.8
$1N5838: length 2.4
  Top Layer w0.254: 27.96,50.6 R26.2
  Top Layer w0.508: U11.1 27.79,50.44 27.96,50.6
$1N5843: length 17.4
  Top Layer w0.508: H8.2 43.61,51.61 43.57,51.61 43.35,51.83 RF8.5 37.92,52.29 R26.1
$1N6032: length 26.2
  Top Layer w0.508: 18.09,52.55 H9.2 16.89,51.48 RF7.5 6.48,51.48 ; 18.09,52.55 18.09,52.67 19.16,53.75 19.16,53.78 19.4,54.02 19.44,54.02 24.54,59.12 H10.1 ; 18.09,52.55 C9.1 18.09,48.16 R24.2
$1N6070: length 5
  Top Layer w0.508: U11.3 27.79,54.26 C10.2 29.07,54.26 R27.1
$1N6153: length 3.9
  Top Layer w0.508: 29.77,56.47 29.77,56.57 H10.2
$1N6159: length 6.1
  Top Layer w0.254: 23.37,52.34 U11.4 ; 20.09,50.26 C9.2
  Top Layer w0.508: 23.37,52.34 20.85,52.34 H9.1 20.09,52.13 20.09,50.26
$1N6676: length 37.3
  Top Layer w0.508: R8.2 R7.2 ; R7.2 R10.2 ; R7.2 47.23,23.16 RF6.5 51.91,23.57 52.06,23.41 52.1,23.41 H6.2

## Copper pours and planes (outline as drawn; the poured copper is in the pictures)
GND on Top Layer: 0.11,40.24 1.35,41.47 54.35,41.47 55.48,40.34 55.48,0.92 54.57,0.01 2.01,0.01 0.11,1.91
GND on Top Layer: 0.01,43.42 48.76,43.42 48.76,98.52 47.25,100.04 2.6,100.04 0.29,97.73 0.01,97.73
GND on Top Layer: -0.03,40.16 1.21,41.39 54.21,41.39 55.34,40.26 55.34,0.84 54.44,-0.07 1.87,-0.07 -0.03,1.83
GND on Bottom Layer: 0.18,40.26 1.42,41.5 54.42,41.5 55.55,40.37 55.55,0.94 54.65,0.04 2.08,0.04 0.18,1.94
GND on Bottom Layer: 0.28,43.45 49.04,43.45 49.04,98.55 47.52,100.07 2.87,100.07 0.56,97.76 0.28,97.76
